# EAGLE schematic freesoc_1.1 (EAGLE 6.3)
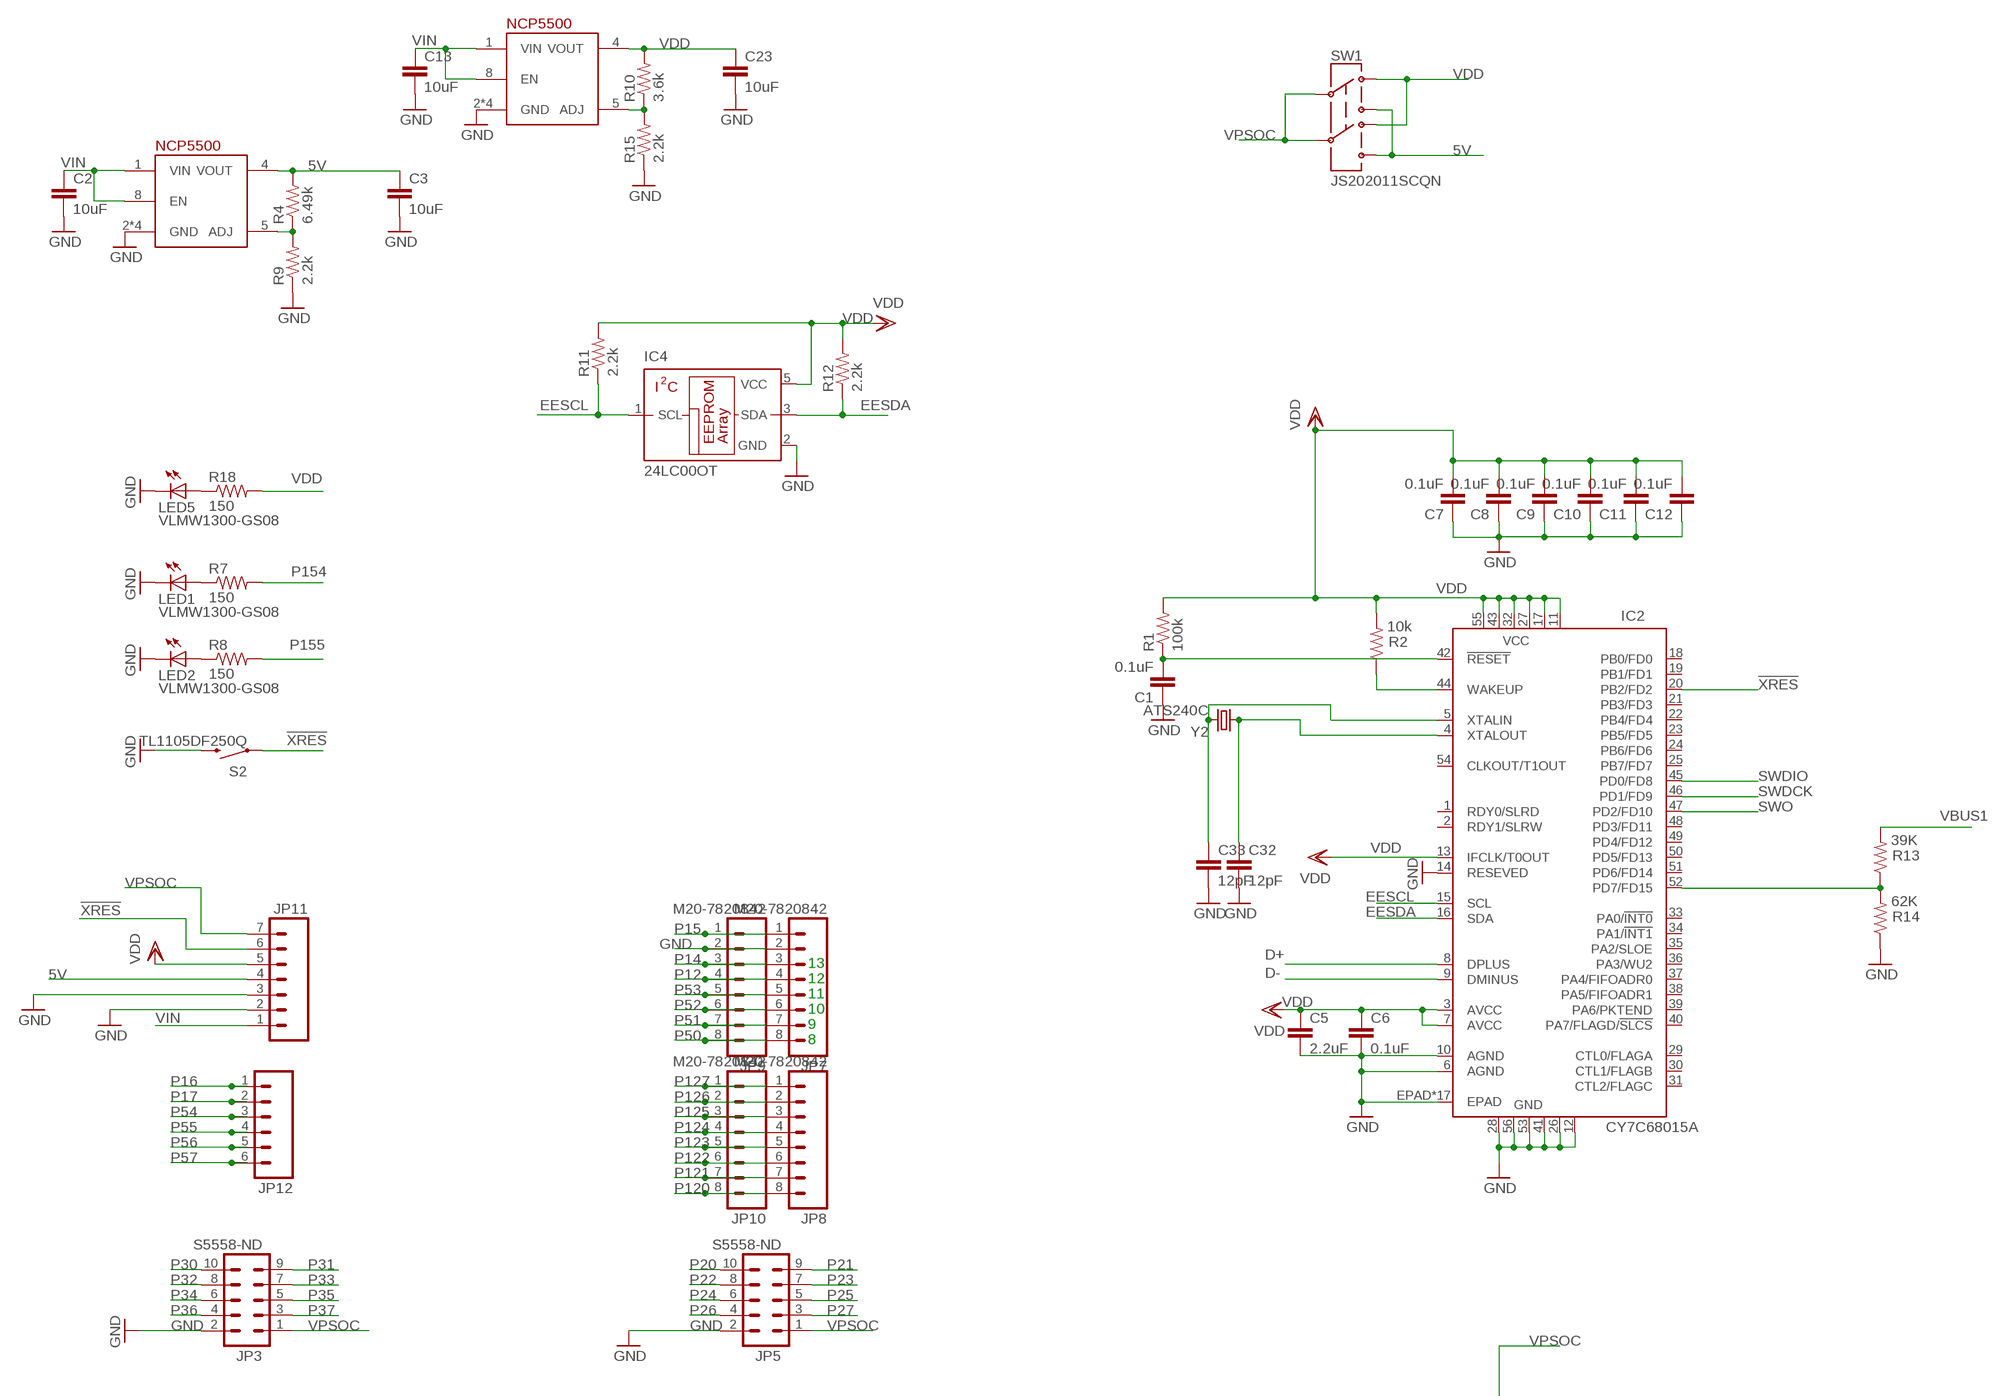
[diagram p0: schematic, sheet 1, part 1 of 2]
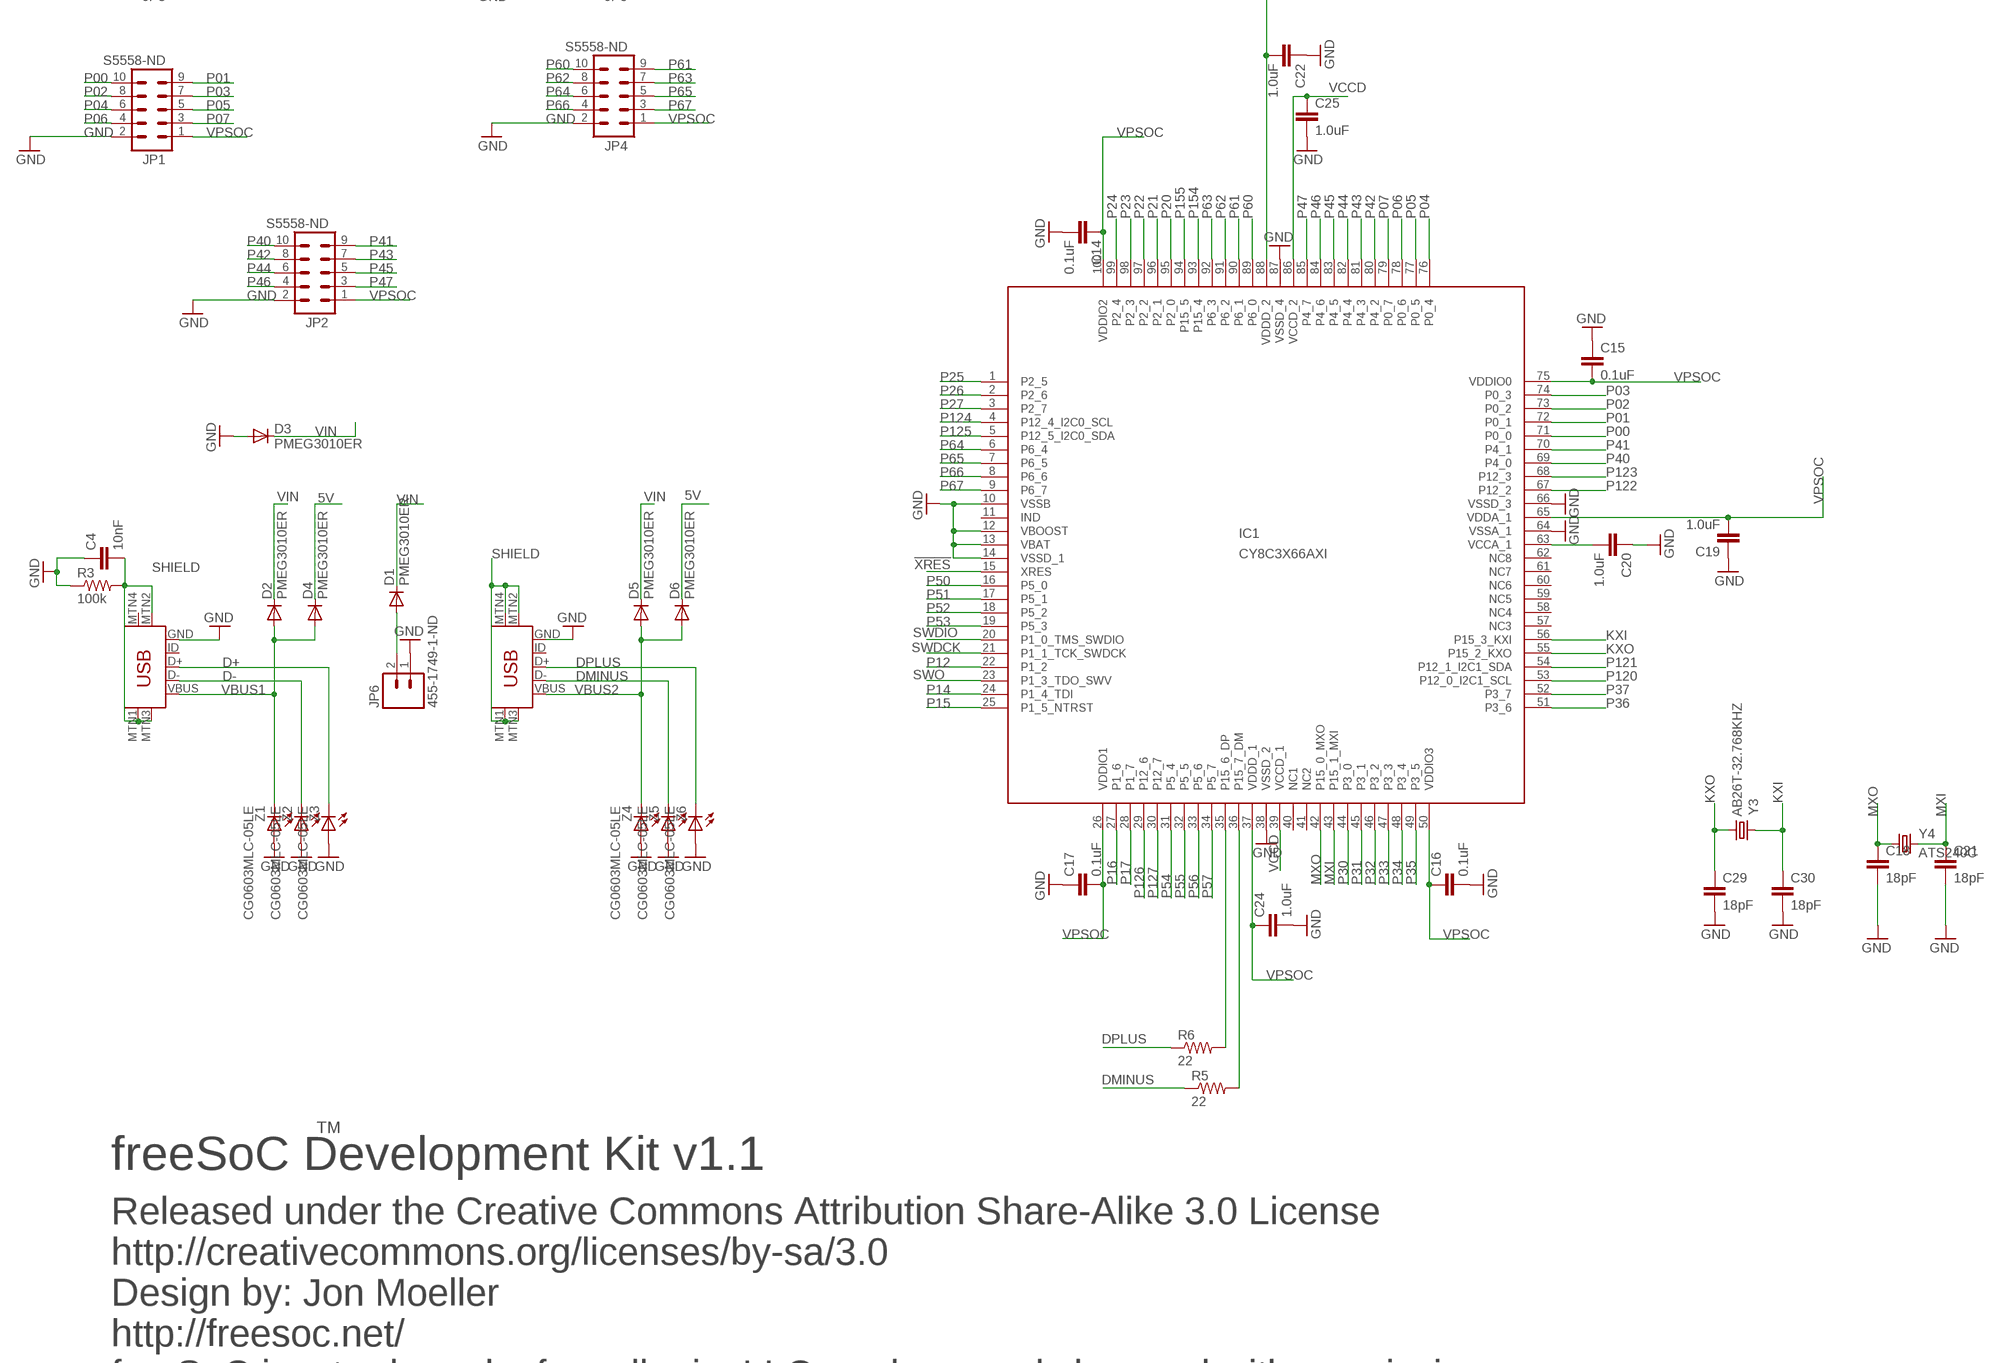
[diagram p1: schematic, sheet 1, part 2 of 2]

## Parts
C1  0.1uF  CAP0402-CAP  [0402-CAP]
C2  10uF  CAP0805  [0805]
C3  10uF  CAP0805  [0805]
C4  10nF  CAP0402-CAP  [0402-CAP]
C5  2.2uF  CAP0603-CAP  [0603-CAP]
C6  0.1uF  CAP0402-CAP  [0402-CAP]
C7  0.1uF  CAP0402-CAP  [0402-CAP]
C8  0.1uF  CAP0402-CAP  [0402-CAP]
C9  0.1uF  CAP0402-CAP  [0402-CAP]
C10  0.1uF  CAP0402-CAP  [0402-CAP]
C11  0.1uF  CAP0402-CAP  [0402-CAP]
C12  0.1uF  CAP0402-CAP  [0402-CAP]
C13  10uF  CAP0805  [0805]
C14  0.1uF  CAP0402-CAP  [0402-CAP]
C15  0.1uF  CAP0402-CAP  [0402-CAP]
C16  0.1uF  CAP0402-CAP  [0402-CAP]
C17  0.1uF  CAP0402-CAP  [0402-CAP]
C18  18pF  CAP0402-CAP  [0402-CAP]
C19  1.0uF  CAP0402-CAP  [0402-CAP]
C20  1.0uF  CAP0402-CAP  [0402-CAP]
C21  18pF  CAP0402-CAP  [0402-CAP]
C22  1.0uF  CAP0402-CAP  [0402-CAP]
C23  10uF  CAP0805  [0805]
C24  1.0uF  CAP0402-CAP  [0402-CAP]
C25  1.0uF  CAP0402-CAP  [0402-CAP]
C29  18pF  CAP0402-CAP  [0402-CAP]
C30  18pF  CAP0402-CAP  [0402-CAP]
C32  12pF  CAP0402-CAP  [0402-CAP]
C33  12pF  CAP0402-CAP  [0402-CAP]
D1  PMEG3010ER  DIODE-SOD123  [SOD123]
D2  PMEG3010ER  DIODE-SOD123  [SOD123]
D3  PMEG3010ER  DIODE-SOD123  [SOD123]
D4  PMEG3010ER  DIODE-SOD123  [SOD123]
D5  PMEG3010ER  DIODE-SOD123  [SOD123]
D6  PMEG3010ER  DIODE-SOD123  [SOD123]
IC1  CY8C3X66AXI  [TQFP-100]
IC2  CY7C68015A  CY7C68015A-56QFNLFXC  [QFN56]
IC4  24LC00OT  [SOT23-5L]
JP1  S5558-ND  M05X2BLANK  [2X5-NS]
JP2  S5558-ND  M05X2BLANK  [2X5-NS]
JP3  S5558-ND  M05X2BLANK  [2X5-NS]
JP4  S5558-ND  M05X2BLANK  [2X5-NS]
JP5  S5558-ND  M05X2BLANK  [2X5-NS]
JP6  455-1749-1-ND  M02-JST-2MM-SMT  [JST-2-SMD]
JP7  M20-7820842  M081X08  [1X08]
JP8  M20-7820842  M081X08  [1X08]
JP9  M20-7820842  M081X08  [1X08]
JP10  M20-7820842  M081X08  [1X08]
JP11  M07  [1X07]
JP12  M06SIP  [1X06]
LED1  VLMW1300-GS08  LED0603  [LED-0603]
LED2  VLMW1300-GS08  LED0603  [LED-0603]
LED5  VLMW1300-GS08  LED0603  [LED-0603]
R1  100k  RESISTOR0402-RES  [0402-RES]
R2  10k  RESISTOR0402-RES  [0402-RES]
R3  100k  RESISTOR0402-RES  [0402-RES]
R4  6.49k  RESISTOR0402-RES  [0402-RES]
R5  22  RESISTOR0805-RES  [0805]
R6  22  RESISTOR0805-RES  [0805]
R7  150  RESISTOR0603-RES  [0603-RES]
R8  150  RESISTOR0603-RES  [0603-RES]
R9  2.2k  RESISTOR0402-RES  [0402-RES]
R10  3.6k  RESISTOR0402-RES  [0402-RES]
R11  2.2k  RESISTOR0402-RES  [0402-RES]
R12  2.2k  RESISTOR0402-RES  [0402-RES]
R13  39K  RESISTOR0402-RES  [0402-RES]
R14  62K  RESISTOR0402-RES  [0402-RES]
R15  2.2k  RESISTOR0402-RES  [0402-RES]
R18  150  RESISTOR0603-RES  [0603-RES]
REG3V3  NCP5500  [SO08]
REG5V0  NCP5500  [SO08]
S2  TL1105DF250Q  SWITCH-MOMENTARY-2PTH  [TACTILE-PTH]
SW1  JS202011SCQN  [JS202011SCQN]
U$5  USB-MINIB-5PIN  [USB-MINIB]
U$6  USB-MINIB-5PIN  [USB-MINIB]
Y2  ATS240C  CRYSTALHC49US  [HC49US]
Y3  AB26T-32.768KHZ  CRYSTAL32-SMD  [CRYSTAL-32KHZ-SMD]
Y4  ATS240C  CRYSTALHC49US  [HC49US]
Z1  CG0603MLC-05LE  LED0603  [LED-0603]
Z2  CG0603MLC-05LE  LED0603  [LED-0603]
Z3  CG0603MLC-05LE  LED0603  [LED-0603]
Z4  CG0603MLC-05LE  LED0603  [LED-0603]
Z5  CG0603MLC-05LE  LED0603  [LED-0603]
Z6  CG0603MLC-05LE  LED0603  [LED-0603]

## Nets
5V: C3.1 D4.C D6.C JP11.4 R4.2 REG5V0.4(VOUT) SW1.B1 SW1.B2
!XRES: IC1.15(XRES) IC2.20(PB2/FD2) JP11.6 S2.1
D+: IC2.8(DPLUS) U$5.D+ Z3.C
D-: IC2.9(DMINUS) U$5.D- Z2.C
DMINUS: R5.1 U$6.D- Z5.C
DPLUS: R6.1 U$6.D+ Z6.C
EESCL: IC2.15(SCL) IC4.1(SCL) R11.1
EESDA: IC2.16(SDA) IC4.3(SDA) R12.1
GND: C1.1 C2.2 C3.2 C4.1 C5.2 C6.2 C7.1 C8.1 C9.1 C10.1 C11.1 C12.1 C13.2 C14.2 C15.1 C16.2 C17.1 C18.2 C19.1 C20.1 C21.2 C22.1 C23.2 C24.2 C25.2 C29.2 C30.2 C32.2 C33.2 D3.A IC1.10(VSSB) IC1.12(VBOOST) IC1.13(VBAT) IC1.14(VSSD_1) IC1.38(VSSD_2) IC1.64(VSSA_1) IC1.66(VSSD_3) IC1.87(VSSD_4) IC2.6(AGND) IC2.10(AGND) IC2.12(GND) IC2.14(RESEVED) IC2.26(GND) IC2.28(GND) IC2.41(GND) IC2.53(GND) IC2.56(GND) IC2.EPAD IC2.P$1(EPAD) IC2.P$2(EPAD) IC2.P$3(EPAD) IC2.P$4(EPAD) IC2.P$5(EPAD) IC2.P$6(EPAD) IC2.P$7(EPAD) IC2.P$8(EPAD) IC2.P$9(EPAD) IC2.P$10(EPAD) IC2.P$11(EPAD) IC2.P$12(EPAD) IC2.P$13(EPAD) IC2.P$14(EPAD) IC2.P$15(EPAD) IC2.P$16(EPAD) IC4.2(GND) JP1.2 JP2.2 JP3.2 JP4.2 JP5.2 JP6.1 JP7.2 JP9.2 JP11.2 JP11.3 LED1.C LED2.C LED5.C R3.1 R9.1 R14.1 R15.1 REG3V3.2(GND) REG3V3.3(GND) REG3V3.6(GND) REG3V3.7(GND) REG5V0.2(GND) REG5V0.3(GND) REG5V0.6(GND) REG5V0.7(GND) S2.3 U$5.GND U$6.GND Z1.A Z2.A Z3.A Z4.A Z5.A Z6.A
KXI: C30.1 IC1.56(P15_3_KXI) Y3.X1
KXO: C29.1 IC1.55(P15_2_KXO) Y3.X2
MXI: C21.1 IC1.43(P15_1_MXI) Y4.2
MXO: C18.1 IC1.42(P15_0_MXO) Y4.1
N$1: C1.2 IC2.42(!RESET) R1.1
N$2: D1.A JP6.2
N$5: IC2.44(WAKEUP) R2.1
N$7: C20.2 IC1.63(VCCA_1)
N$8: IC1.35(P15_6_DP) R6.2
N$9: IC1.36(P15_7_DM) R5.2
N$11: LED1.A R7.1
N$12: LED2.A R8.1
N$13: R10.1 R15.2 REG3V3.5(ADJ)
N$15: IC2.52(PD7/FD15) R13.1 R14.2
N$18: LED5.A R18.1
N$25: R4.1 R9.2 REG5V0.5(ADJ)
P00: IC1.71(P0_0) JP1.10
P01: IC1.72(P0_1) JP1.9
P02: IC1.73(P0_2) JP1.8
P03: IC1.74(P0_3) JP1.7
P04: IC1.76(P0_4) JP1.6
P05: IC1.77(P0_5) JP1.5
P06: IC1.78(P0_6) JP1.4
P07: IC1.79(P0_7) JP1.3
P12: IC1.22(P1_2) JP7.4 JP9.4
P14: IC1.24(P1_4_TDI) JP7.3 JP9.3
P15: IC1.25(P1_5_NTRST) JP7.1 JP9.1
P16: IC1.27(P1_6) JP12.1
P17: IC1.28(P1_7) JP12.2
P20: IC1.95(P2_0) JP5.10
P21: IC1.96(P2_1) JP5.9
P22: IC1.97(P2_2) JP5.8
P23: IC1.98(P2_3) JP5.7
P24: IC1.99(P2_4) JP5.6
P25: IC1.1(P2_5) JP5.5
P26: IC1.2(P2_6) JP5.4
P27: IC1.3(P2_7) JP5.3
P30: IC1.44(P3_0) JP3.10
P31: IC1.45(P3_1) JP3.9
P32: IC1.46(P3_2) JP3.8
P33: IC1.47(P3_3) JP3.7
P34: IC1.48(P3_4) JP3.6
P35: IC1.49(P3_5) JP3.5
P36: IC1.51(P3_6) JP3.4
P37: IC1.52(P3_7) JP3.3
P40: IC1.69(P4_0) JP2.10
P41: IC1.70(P4_1) JP2.9
P42: IC1.80(P4_2) JP2.8
P43: IC1.81(P4_3) JP2.7
P44: IC1.82(P4_4) JP2.6
P45: IC1.83(P4_5) JP2.5
P46: IC1.84(P4_6) JP2.4
P47: IC1.85(P4_7) JP2.3
P50: IC1.16(P5_0) JP7.8 JP9.8
P51: IC1.17(P5_1) JP7.7 JP9.7
P52: IC1.18(P5_2) JP7.6 JP9.6
P53: IC1.19(P5_3) JP7.5 JP9.5
P54: IC1.31(P5_4) JP12.3
P55: IC1.32(P5_5) JP12.4
P56: IC1.33(P5_6) JP12.5
P57: IC1.34(P5_7) JP12.6
P60: IC1.89(P6_0) JP4.10
P61: IC1.90(P6_1) JP4.9
P62: IC1.91(P6_2) JP4.8
P63: IC1.92(P6_3) JP4.7
P64: IC1.6(P6_4) JP4.6
P65: IC1.7(P6_5) JP4.5
P66: IC1.8(P6_6) JP4.4
P67: IC1.9(P6_7) JP4.3
P120: IC1.53(P12_0_I2C1_SCL) JP8.8 JP10.8
P121: IC1.54(P12_1_I2C1_SDA) JP8.7 JP10.7
P122: IC1.67(P12_2) JP8.6 JP10.6
P123: IC1.68(P12_3) JP8.5 JP10.5
P124: IC1.4(P12_4_I2C0_SCL) JP8.4 JP10.4
P125: IC1.5(P12_5_I2C0_SDA) JP8.3 JP10.3
P126: IC1.29(P12_6) JP8.2 JP10.2
P127: IC1.30(P12_7) JP8.1 JP10.1
P154: IC1.93(P15_4) R7.2
P155: IC1.94(P15_5) R8.2
SHIELD: C4.2 R3.2 U$5.MTN1(MTN2) U$5.MTN2(MTN3) U$5.MTN3(MTN1) U$6.MTN1(MTN2) U$6.MTN2(MTN3) U$6.MTN3(MTN1) U$6.MTN4
SWDCK: IC1.21(P1_1_TCK_SWDCK) IC2.46(PD1/FD9)
SWDIO: IC1.20(P1_0_TMS_SWDIO) IC2.45(PD0/FD8)
SWO: IC1.23(P1_3_TDO_SWV) IC2.47(PD2/FD10)
VBUS1: D2.A D4.A R13.2 U$5.VBUS Z1.C
VBUS2: D5.A D6.A U$6.VBUS Z4.C
VCCD: C25.1 IC1.39(VCCD_1) IC1.86(VCCD_2)
VDD: C5.1 C6.1 C7.2 C8.2 C9.2 C10.2 C11.2 C12.2 C23.1 IC2.3(AVCC) IC2.7(AVCC) IC2.11(VCC) IC2.13(IFCLK/T0OUT) IC2.17(VCC) IC2.27(VCC) IC2.32(VCC) IC2.43(VCC) IC2.55(VCC) IC4.5(VCC) JP11.5 R1.2 R2.2 R10.2 R11.2 R12.2 R18.2 REG3V3.4(VOUT) SW1.A1 SW1.A2
VIN: C2.1 C13.1 D1.C D2.C D3.C D5.C JP11.1 REG3V3.1(VIN) REG3V3.8(EN) REG5V0.1(VIN) REG5V0.8(EN)
VPSOC: C14.1 C15.2 C16.1 C17.2 C19.2 C22.2 C24.1 IC1.26(VDDIO1) IC1.37(VDDD_1) IC1.50(VDDIO3) IC1.65(VDDA_1) IC1.75(VDDIO0) IC1.88(VDDD_2) IC1.100(VDDIO2) JP1.1 JP2.1 JP3.1 JP4.1 JP5.1 JP11.7 SW1.C1 SW1.C2
XIN: C33.1 IC2.5(XTALIN) Y2.2
XOUT: C32.1 IC2.4(XTALOUT) Y2.1
Unconnected: IC1.11(IND) IC1.40(NC1) IC1.41(NC2) IC1.57(NC3) IC1.58(NC4) IC1.59(NC5) IC1.60(NC6) IC1.61(NC7) IC1.62(NC8) IC2.1(RDY0/SLRD) IC2.2(RDY1/SLRW) IC2.18(PB0/FD0) IC2.19(PB1/FD1) IC2.21(PB3/FD3) IC2.22(PB4/FD4) IC2.23(PB5/FD5) IC2.24(PB6/FD6) IC2.25(PB7/FD7) IC2.29(CTL0/FLAGA) IC2.30(CTL1/FLAGB) IC2.31(CTL2/FLAGC) IC2.33(PA0/!INT0) IC2.34(PA1/!INT1) IC2.35(PA2/SLOE) IC2.36(PA3/WU2) IC2.37(PA4/FIFOADR0) IC2.38(PA5/FIFOADR1) IC2.39(PA6/PKTEND) IC2.40(PA7/FLAGD/!SLCS) IC2.48(PD3/FD11) IC2.49(PD4/FD12) IC2.50(PD5/FD13) IC2.51(PD6/FD14) IC2.54(CLKOUT/T1OUT) U$5.ID U$5.MTN4 U$6.ID

## Notes on the sheet
- 13
- 12
- 11
- 10
- 9
- 8
- TM
- freeSoC Development Kit v1.1
- Released under the Creative Commons Attribution Share-Alike 3.0 License
- http://creativecommons.org/licenses/by-sa/3.0
- Design by: Jon Moeller
- http://freesoc.net/
- freeSoC is a trademark of moeller.io, LLC, and may only be used with permission

## Library data of the parts
C1 C6-C12 C14-C17 = SparkFun:CAP: Capacitor Standard 0603 ceramic capacitor, and 0.1" leaded capacitor.; PN: LMK105BJ104KV-F
C2 C3 C13 C23 = SparkFun:CAP: Capacitor Standard 0603 ceramic capacitor, and 0.1" leaded capacitor.; PN: C0805C106K4PACTU
C4 = SparkFun:CAP: Capacitor Standard 0603 ceramic capacitor, and 0.1" leaded capacitor.; PN: TMK105B7103KV-F
C5 = SparkFun:CAP: Capacitor Standard 0603 ceramic capacitor, and 0.1" leaded capacitor.; PN: CC0603KRX5R5BB225
C18 C21 C29 C30 = SparkFun:CAP: Capacitor Standard 0603 ceramic capacitor, and 0.1" leaded capacitor.; PN: GRM1555C1H180FZ01D
C19 C20 C22 C24 C25 = SparkFun:CAP: Capacitor Standard 0603 ceramic capacitor, and 0.1" leaded capacitor.; PN: JMK105BJ105KV-F
C32 C33 = SparkFun:CAP: Capacitor Standard 0603 ceramic capacitor, and 0.1" leaded capacitor.; PN: GRM1555C1H120FZ01D
D1-D6 = diode:DIODE-: DIODE; PN: PMEG3010ER
IC1 = PSoC3:CY8C3X66AXI: CY8C_pins edit this description Auto generated by make-symbol-device-package-bsdl.ulp Rev. 34 Source: CY8C_pins.txt; PN: CY8C5568AXI-060
IC2 = cypress:CY7C6801*A-56QFN: EZ-USB FX2LP (TM) USB Microcontroller Source: http://www.cypress.com .. cy7c68013a_5.pdf; PN: CY7C68013A-56LTXC
IC4 = microchip:24*00: Serial EEPROM 128 bit, I2C (AA = 1.8 V/LC = 2.5 V/C = 5.0 V); PN: 24LC00T
JP1-JP5 = SparkFun:M05X2: Header 5x2 Standard 10-pin dual row 0.1" header. Commonly used with AVR-ISP. Use with Spark Fun Electronics SKU: PRT-00778
JP6 = SparkFun:M02: Header 2 Standard 2-pin 0.1" header. Use with straight break away headers (SKU : PRT-00116), right angle break away headers (PRT-00553), swiss pins (PRT-00743), machine pins (PRT-00117), and female headers (PRT-00115). Molex polarized connector foot print use with SKU : PRT-08233 with associated crimp pins and housings.; PN: S2B-PH-SM4-TB
JP7-JP10 = SparkFun:M08: Header 8 Standard 8-pin 0.1" header. Use with straight break away headers (SKU : PRT-00116), right angle break away headers (PRT-00553), swiss pins (PRT-00743), machine pins (PRT-00117), and female headers (PRT-00115).
JP11 = SparkFun:M07: Header 7 Standard 7-pin 0.1" header. Use with straight break away headers (SKU : PRT-00116), right angle break away headers (PRT-00553), swiss pins (PRT-00743), machine pins (PRT-00117), and female headers (PRT-00115). NOTES ON THE VARIANTS LOCK and LOCK_LONGPADS... This footprint was designed to help hold the alignment of a through-hole component (i.e. 7-pin header) while soldering it into place. You may notice that each hole has been shifted either up or down by 0.005 of an inch from it's more standard position (which is usually a perfectly straight line). This slight alteration caused the pins (the squares in the middle) to touch the edges of the holes. Because they are alternating, it causes a "brace" to hold the header in place. 0.005 has proven to be the perfect amount of "off-center" position when using our standard breakaway headers. Although looks a little odd when you look at the bare footprint, once you have a header in there, the alteration is very hard to notice. Also, if you push a header all the way into place, it is covered up entirely on the bottom side. This idea of altering the position of holes to aid alignment will be further integrated into the Sparkfun Library for other footprints. It can help hold any component with 3 or more connection pins.
JP12 = SparkFun:M06: Header 6 Standard 6-pin 0.1" header. Use with straight break away headers (SKU : PRT-00116), right angle break away headers (PRT-00553), swiss pins (PRT-00743), machine pins (PRT-00117), and female headers (PRT-00115). Molex polarized connector foot print use with SKU : PRT-08094 with associated crimp pins and housings. NOTES ON THE VARIANTS LOCK and LOCK_LONGPADS... This footprint was designed to help hold the alignment of a through-hole component (i.e. 6-pin header) while soldering it into place. You may notice that each hole has been shifted either up or down by 0.005 of an inch from it's more standard position (which is a perfectly straight line). This slight alteration caused the pins (the squares in the middle) to touch the edges of the holes. Because they are alternating, it causes a "brace" to hold the component in place. 0.005 has proven to be the perfect amount of "off-center" position when using our standard breakaway headers. Although looks a little odd when you look at the bare footprint, once you have a header in there, the alteration is very hard to notice. Also, if you push a header all the way into place, it is covered up entirely on the bottom side. This idea of altering the position of holes to aid alignment will be further integrated into the Sparkfun Library for other footprints. It can help hold any component with 3 or more connection pins.
LED1 LED2 LED5 = SparkFun:LED: LEDs Standard schematic elements and footprints for 5mm, 3mm, 1206, and 0603 sized LEDs. 5mm - Spark Fun Electronics SKU : COM-00529 (and others); PN: VLMW1300-GS08
R1 R3 = SparkFun:RESISTOR: Resistor Basic schematic elements and footprints for 0603, 1206, and PTH resistors.; PN: RR0510P-104-D
R2 = SparkFun:RESISTOR: Resistor Basic schematic elements and footprints for 0603, 1206, and PTH resistors.; PN: ERJ-2GEJ103X
R4 = SparkFun:RESISTOR: Resistor Basic schematic elements and footprints for 0603, 1206, and PTH resistors.; PN: CRCW04026R49FKED
R5 R6 = SparkFun:RESISTOR: Resistor Basic schematic elements and footprints for 0603, 1206, and PTH resistors.; PN: ERA-6AHD220V
R7 R8 R18 = SparkFun:RESISTOR: Resistor Basic schematic elements and footprints for 0603, 1206, and PTH resistors.; PN: CRCW0603150RFKEA
R9 R11 R12 R15 = SparkFun:RESISTOR: Resistor Basic schematic elements and footprints for 0603, 1206, and PTH resistors.; PN: ERJ-2RKF2201X
R10 = SparkFun:RESISTOR: Resistor Basic schematic elements and footprints for 0603, 1206, and PTH resistors.; PN: ERJ-2RKF3601X
R13 R14 = SparkFun:RESISTOR: Resistor Basic schematic elements and footprints for 0603, 1206, and PTH resistors.
REG3V3 REG5V0 = SparkFun:NCP5500; PN: NCP5500DADJR2G
S2 = SparkFun:SWITCH-MOMENTARY-2; PN: TL1105F160Q
SW1 = SparkFun:JS202011SCQN; PN: JS202011SCQN
U$5 U$6 = SparkFun:USB-MINIB: Mini-USB "B" connector with 5th pin broken out. Created new symbol breaking out 5th "ID" pin in mini/micro USB connector spec. See: http://en.wikipedia.org/wiki/Mini_usb#Cables. Uses same footprint as 4-pin symbol. Also added pins to connect to mounting / shield pads if required (probably not generally needed as signals aren't shielded once they leave the connector).; PN: 10033526-N3212LF
Y2 Y4 = SparkFun:CRYSTAL: Crystals Various standard crystals. Proven footprints. Spark Fun Electronics SKU : COM-00534; PN: ATS240C
Y3 = SparkFun:CRYSTAL: Crystals Various standard crystals. Proven footprints. Spark Fun Electronics SKU : COM-00534; PN: AB26T-32.768KHZ
Z1-Z6 = SparkFun:LED: LEDs Standard schematic elements and footprints for 5mm, 3mm, 1206, and 0603 sized LEDs. 5mm - Spark Fun Electronics SKU : COM-00529 (and others); PN: CG0603MLC-05LE